# EasyEDA Pro project ProDoc_P1_2025-07-30.epro

# Schematic Schematic2_1
Board Name: v2; Create Date: 2025-06-19; Page Name: P1; Project Name: 恒流boost驱动; Schematic Name: Schematic2_1; Update Date: 2025-06-27; Company: 嘉立创EDA; Page Size: A4; Version: V1.0
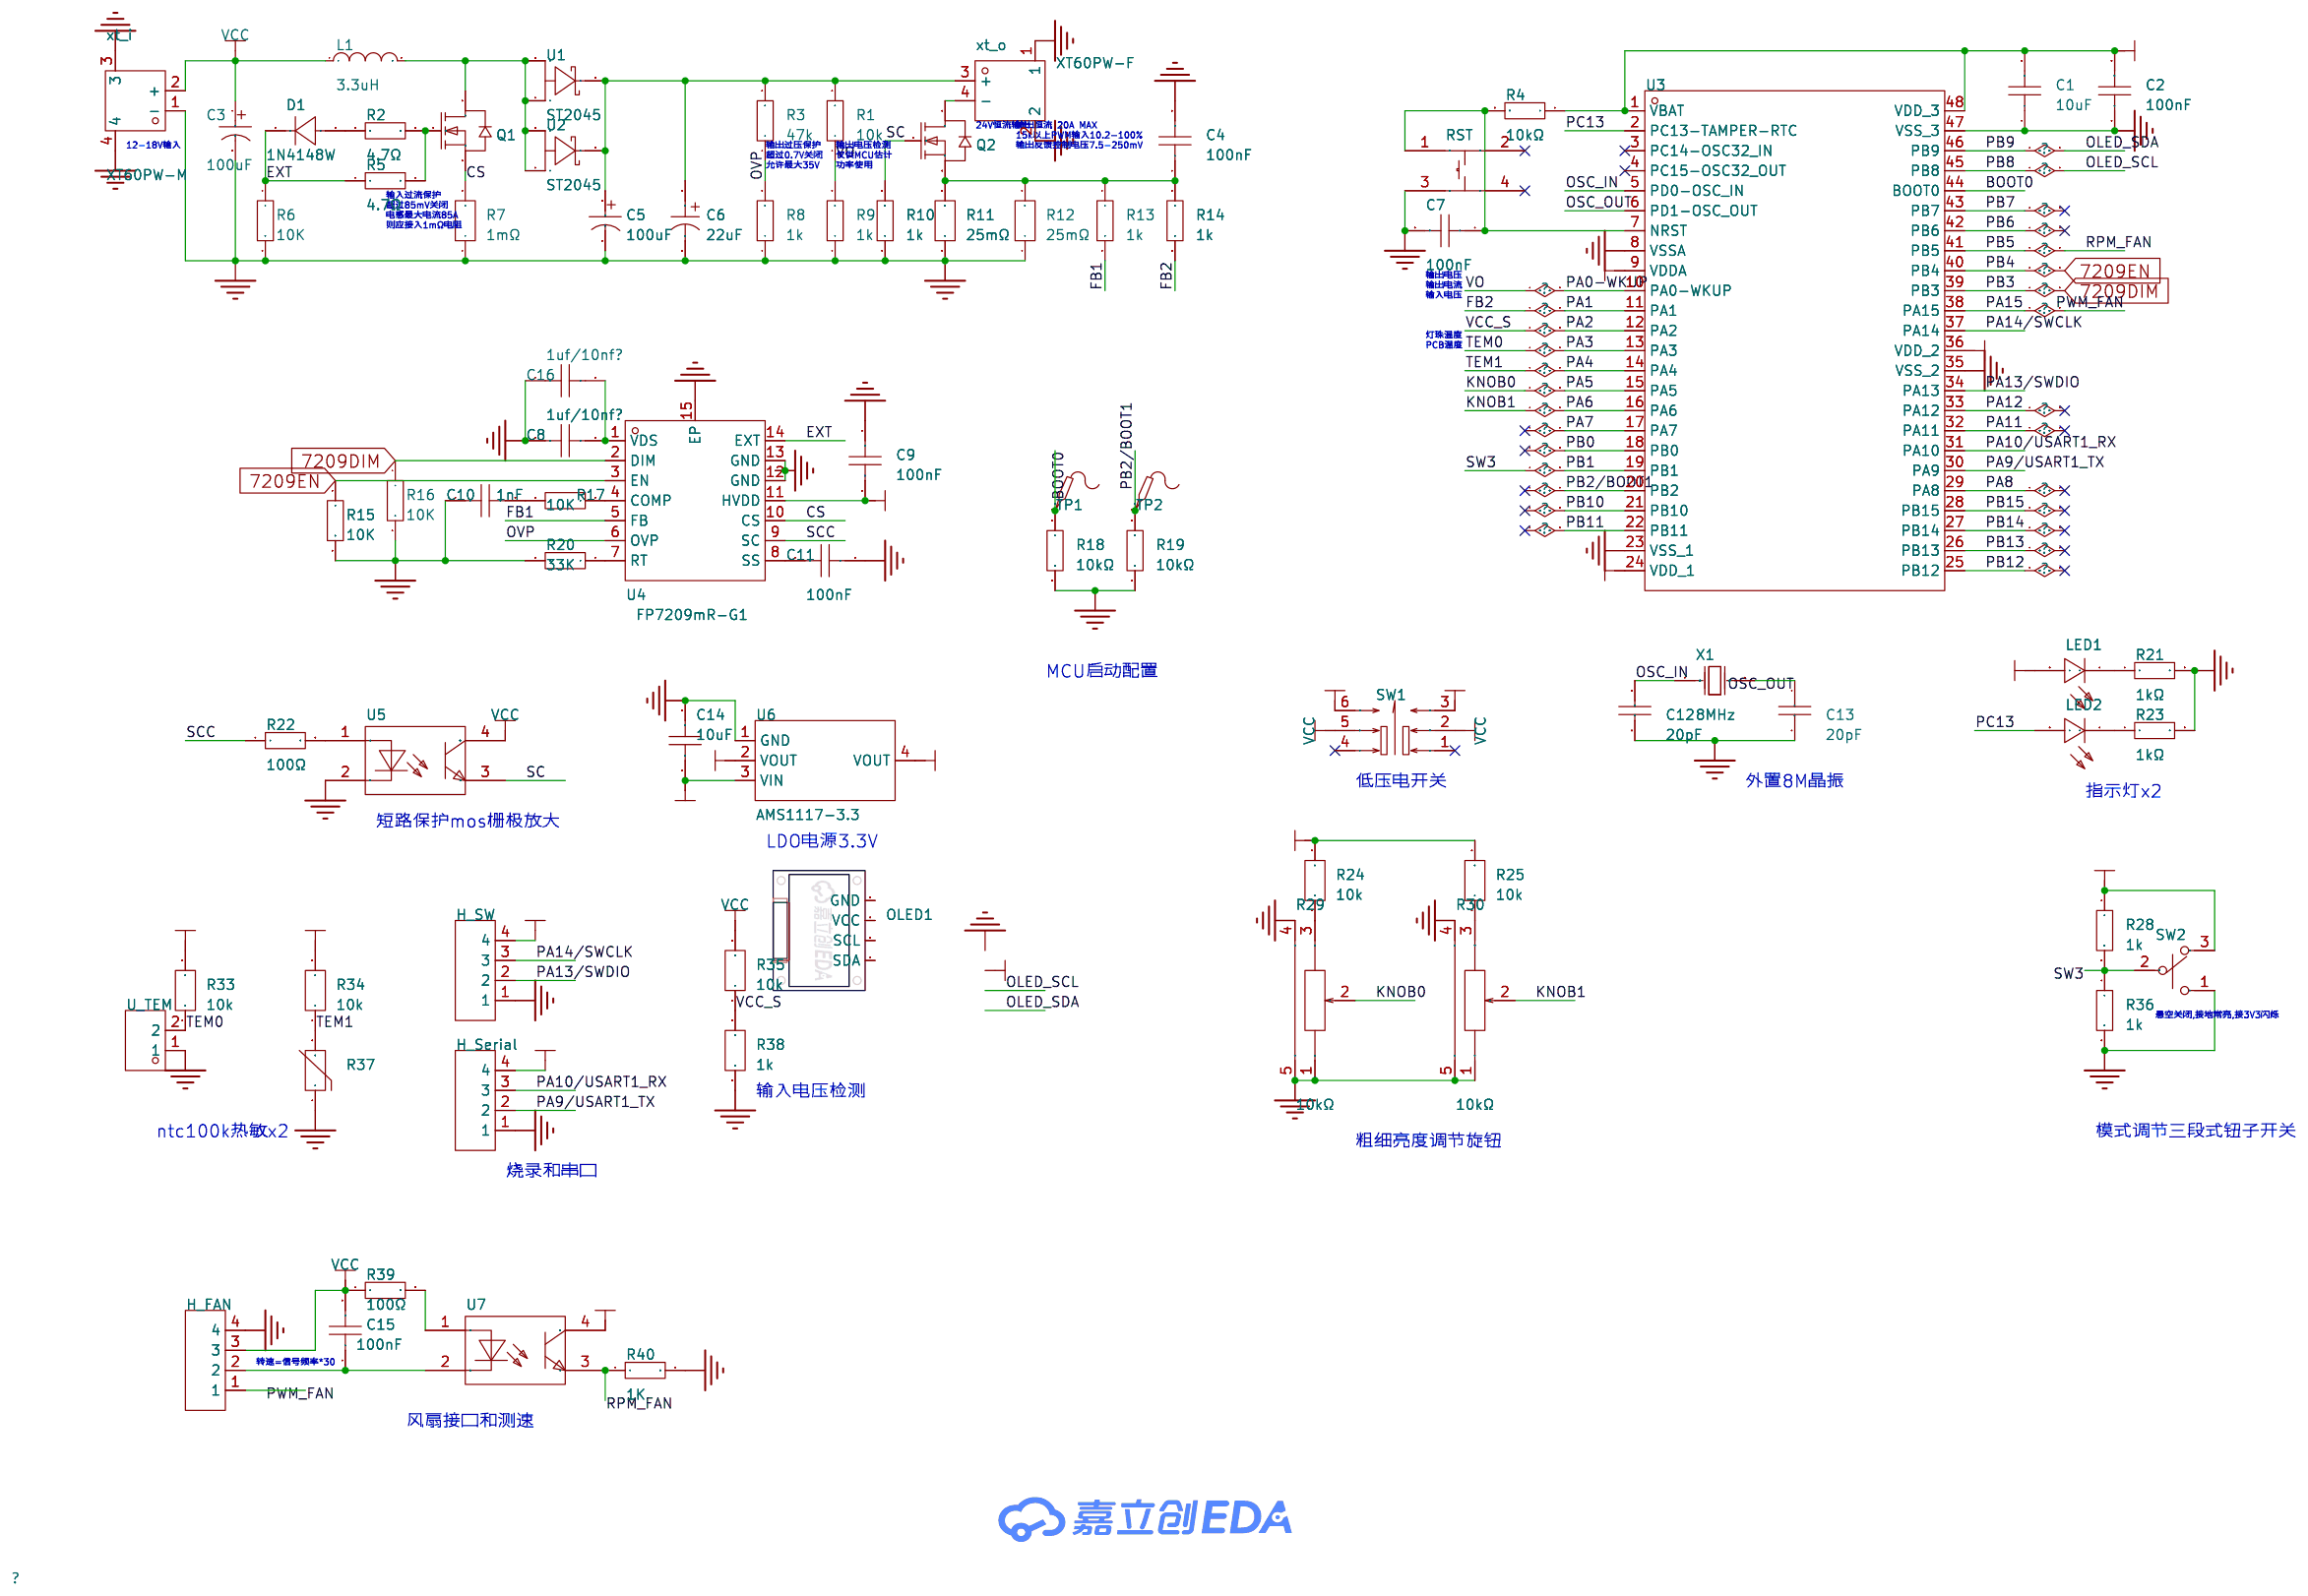
[diagram p0: schematic sheet]

## Parts
C1  10uF  [C0603]
C2  100nF  [C0603]
C3  100uF  [CAP-TH_BD8.0-P3.50-D0.6-FD]
C4  100nF  [C0603]
C5  100uF  [CAP-TH_BD8.0-P3.50-D0.6-FD]
C6  22uF  [CAP-SMD_BD6.3-L6.6-W6.6-LS7.2-R-RD-1]
C7  100nF  [C0603]
C8  1uf/10nf?  [C0603]
C9  100nF  [C0603]
C10  1nF  [C0603]
C11  100nF  [C0603]
C12  20pF  [C0603]
C13  20pF  [C0603]
C14  10uF  [C0603]
C15  100nF  [C0603]
C16  1uf/10nf?  [C0603]
D1  1N4148W  [SOD-123_L2.7-W1.6-LS3.8-RD]
H_FAN  PZ254R-11-04P  [HDR-TH_4P-P2.54-H-M-W10.4]
H_Serial  PZ254R-11-04P  [HDR-TH_4P-P2.54-H-M-W10.4]
H_SW  PZ254R-11-04P  [HDR-TH_4P-P2.54-H-M-W10.4]
L1  3.3uH  [IND-SMD_L17.5-W17.2]
LED1  NCD0603R1  [LED0603-RD_RED]
LED2  NCD0603R1  [LED0603-RD_RED]
OLED1  -  [0.96OLED_4P]
Q1  NCE6080K  [TO-252-2_L6.6-W6.1-P4.57-LS10.1-BR-CW]
Q2  NCE6080K  [TO-252-2_L6.6-W6.1-P4.57-LS10.1-BR-CW]
R1  10k  [R0603]
R2  4.7Ω  [R0603]
R3  47k  [R0603]
R4  10kΩ  [R0603]
R5  4.7Ω  [R0603]
R6  10K  [R0603]
R7  1mΩ  [R2512]
R8  1k  [R0603]
R9  1k  [R0603]
R10  1k  [R0603]
R11  25mΩ  [R2512]
R12  25mΩ  [R2512]
R13  1k  [R0603]
R14  1k  [R0603]
R15  10K  [R0603]
R16  10K  [R0603]
R17  10K  [R0603]
R18  10kΩ  [R0603]
R19  10kΩ  [R0603]
R20  33K  [R0603]
R21  1kΩ  [R0603]
R22  100Ω  [R0603]
R23  1kΩ  [R0603]
R24  10k  [R0603]
R25  10k  [R0603]
R28  1k  [R0603]
R29  10kΩ  [RES-TH_RK09K1130A70]
R30  10kΩ  [RES-TH_RK09K1130A70]
R33  10k  [R0603]
R34  10k  [R0603]
R35  10k  [R0603]
R36  1k  [R0603]
R37  TCTR0603F100KF4310T  [R0603]
R38  1k  [R0603]
R39  100Ω  [R0603]
R40  1K  [R0603]
RST  TS-1002S-07526C  [SW-SMD_4P-L6.0-W6.0-P4.50-LS9.0-2]
SW1  SP-2214  [SW-TH_6P-L8.5-W8.5-P2.54_SP-2214]
SW2  MT-0-103-A101-M200-RS  [SW-TH_MT-0-103-A101-M200-RS]
TP1  -  [Test-Point-0.5mm]
TP2  -  [Test-Point-0.5mm]
U1  ST2045  [TO-277_3P-L5.4-W4.0-LS6.5-BR]
U2  ST2045  [TO-277_3P-L5.4-W4.0-LS6.5-BR]
U3  STM32F103C8T6  [LQFP-48_L7.0-W7.0-P0.50-LS9.0-BL]
U4  FP7209mR-G1  [TSSOP-14_L5.0-W4.4-P0.65-LS6.4-BL-EP]
U5  PC817C  [DIP-4_L4.6-W6.5-P2.54-LS7.6-BL]
U6  AMS1117-3.3  [SOT-223-3_L6.5-W3.4-P2.30-LS7.0-BR]
U7  PC817C  [DIP-4_L4.6-W6.5-P2.54-LS7.6-BL]
U_TEM  ZX-XH2.54-2PWZ  [CONN-TH_2P-P2.50_ZX-XH2.54-2PWZ]
X1  8MHz  [OSC-TH_L10.0-W4.5-P5.00]
xt_i  XT60PW-M  [CONN-TH_XT60PW-M]
xt_o  XT60PW-F  [TH_2P-XT60PW-F]

## Library data of the parts
C1 C2 C4 C7 C14 = CGA0603X5R105K500JT: 容值:1uF;精度:±10%;额定电压:50V;材质(温度系数):X5R;; LCSC Part Name: 1uF ±10% 50V; Supplier Part: C6119852; Manufacturer: HRE(芯声); Supplier Footprint: 0603; JLCPCB Part Class: 扩展库; Supplier: LCSC; Tolerance: ±10%; Voltage Rated: 50V; Temperature Coefficient: X5R
C3 C5 = KM107M050F12RR0VH2FP0: 容值:100uF;精度:±20%;额定电压:50V;; LCSC Part Name: 100uF ±20% 50V; Supplier Part: C2749; Manufacturer: CX(承兴); Supplier Footprint: 插件,D8xL12mm; JLCPCB Part Class: 扩展库; Datasheet: https://atta.szlcsc.com/upload/public/pdf/source/20211027/06D6BA3719C264B639DC286D935D03EA.pdf; Supplier: LCSC; Tolerance: ±20%; Rated Voltage: 50V; Lead Spacing: 3.5mm; φD: 8mm; L: 12mm; Lifetime @ Temp: 2000hrs@105℃
C6 = HV1H226M0605PZ: 容值:22uF;精度:±20%;额定电压:50V;; LCSC Part Name: 22uF ±20% 50V; Supplier Part: C5246560; Manufacturer: HONOR(荣誉); Supplier Footprint: SMD,D6.3xL5.8mm; JLCPCB Part Class: 扩展库; Datasheet: https://atta.szlcsc.com/upload/public/pdf/source/20221103/F889AFCC379E96C645A0A58E4BAC43B0.pdf; Supplier: LCSC; Tolerance: ±20%; Rated Voltage: 50V; φD: 6.3mm; L: 5mm; Operating Temperature: -55℃~+105℃
C8-C11 C15 C16 = CAP_0603: Supplier Footprint: 0603
C12 C13 = CL10C200JB8NNNC: 容值:20pF;精度:±5%;额定电压:50V;材质(温度系数):C0G;; LCSC Part Name: 20pF ±5% 50V; Supplier Part: C1648; Manufacturer: SAMSUNG(三星); Supplier Footprint: 0603; JLCPCB Part Class: 基础库; Datasheet: https://atta.szlcsc.com/upload/public/pdf/source/20160218/1457707763339.pdf; Supplier: LCSC; Tolerance: ±5%; Voltage Rated: 50V; Temperature Coefficient: C0G
D1 = 1N4148W_C909967: 二极管配置:独立式;正向压降(Vf):1.25V@150mA;直流反向耐压(Vr):100V;整流电流:-;反向恢复时间(Trr):-;; LCSC Part Name: 电压:100V 电流:150mA; Supplier Part: C909967; Manufacturer: GOODWORK(固得沃克); Supplier Footprint: SOD-123; JLCPCB Part Class: 扩展库; Datasheet: https://atta.szlcsc.com/upload/public/pdf/source/20240802/BA80D71F54142D28B058A528BF89B76A.pdf; Supplier: LCSC; Diode Configuration: 独立式; Voltage - Forward(Vf@If): 1.25V@150mA; Voltage - DC Reverse(Vr): 100V; Reverse Leakage Current (Ir): 1uA@100V; Operating Temperature: -55℃~+150℃@(Tj)
H_FAN H_Serial H_SW = PZ254R-11-04P: 插针结构:1x4P;间距:2.54mm;行距:-;圆针/方针:方针;安装方式:弯插;排数:单排;总PIN位数:4P;额定电流:-;额定电压:-;配合针长度:6mm;塑高:2.5mm;触头材质:黄铜;触头镀层:-;工作温度:-40℃~+105℃;颜色:黑色;; LCSC Part Name: 1x4P 间距:2.54mm 方针 弯插; Supplier Part: C492412; Manufacturer: XFCN(兴飞); Supplier Footprint: 弯插,P=2.54mm; JLCPCB Part Class: 扩展库; Datasheet: https://atta.szlcsc.com/upload/public/pdf/source/20200309/C492412_B0EFFC1946AB079B8871416C4A09EF6C.pdf; Supplier: LCSC; Pin Structure: 1x4P; Pitch: 2.54mm; Circluar Pins/Square Pins: 方针; Mounting Type: 弯插; Number of Rows: 单排; Number of Pins: 4P; Length of Mating Pin: 6mm; Insulation Height: 2.5mm; Contact Material: 黄铜; Operating Temperature: -40℃~+105℃; Color: 黑色
L1 = SMMS1770-6R8M: 电感值:6.8uH;精度:±20%;额定电流:19A;饱和电流(Isat):32A;类型:一体成型电感;; LCSC Part Name: 6.8uH ±20% 32A; Supplier Part: C2976966; Manufacturer: SXN(顺翔诺); Supplier Footprint: SMD,17.5x17.15x7mm; JLCPCB Part Class: 扩展库; Datasheet: https://atta.szlcsc.com/upload/public/pdf/source/20220224/D8C8E12B51A4AD75CA32F676574334C0.pdf; Supplier: LCSC; Tolerance: ±20%; Rated Current: 19A; Saturation Current (Isat): 32A; DC Resistance (DCR): 9.2mΩ; Type: 一体成型电感
LED1 LED2 = NCD0603R1_C84263: 灯头类型:-;发光颜色:红色;正向电压(VF):1.6V~2.6V;功率:65mW;正向电流:20mA;主波长:615nm~630nm;二极管配置:独立二极管;透镜颜色:无色透明透镜;色温:-;发光强度:80mcd~220mcd;发光角度:130°;载带方式:-;工作温度:-30℃~+85℃;; Supplier Part: C84263; Manufacturer: 国星光电; Supplier Footprint: 0603; JLCPCB Part Class: 扩展库; Datasheet: https://atta.szlcsc.com/upload/public/pdf/source/20200820/C84263_DABC6A75E58F576973B407FDBA283D60.pdf; Supplier: LCSC; Emitted Color: 红色; Forward Voltage (VF): 1.6V~2.6V; Power Dissipation: 65mW; Forward Current: 20mA; Dominant Wavelength: 615nm~630nm; Diode Configuration: 独立二极管; Lens Color: 无色透明透镜; Luminous Intensity: 80mcd~220mcd; Viewing Angle: 130°; Operating Temperature: -30℃~+85℃
OLED1 = 0.96OLED模块_4P: Supplier Footprint: 插件
Q1 Q2 = NCE6080K: 类型:1个N沟道;漏源电压(Vdss):60V;连续漏极电流(Id):80A;导通电阻(RDS(on)):8.5mΩ@10V,20A;耗散功率(Pd):110W;阈值电压(Vgs(th)):4V;; LCSC Part Name: 1个N沟道 耐压:60V 电流:80A; Supplier Part: C341705; Manufacturer: NCE(无锡新洁能); Supplier Footprint: TO-252-2; JLCPCB Part Class: 扩展库; Datasheet: https://atta.szlcsc.com/upload/public/pdf/source/20181205/C341705_A98BB2E94DE599C81CD1E648BE453360.pdf; Supplier: LCSC; Type: 1个N沟道; Drain to Source Voltage: 60V; Current - Continuous Drain(Id): 80A; RDS(on): 8.5mΩ@10V,20A; Pd - Power Dissipation: 110W; Gate Threshold Voltage (Vgs(th)@Id): 4V; Gate Charge(Qg): 60nC; Input Capacitance(Ciss@Vds): 4nF@30V; Reverse Transfer Capacitance (Crss@Vds): 210pF@30V; Operating Temperature: -55℃~+175℃
R1-R3 R5 R6 R8-R10 R13-R17 R20 R22 R28 R36 R39 R40 = Res_0603: Supplier Footprint: 0603
R4 R18 R19 R21 R23 = 0603WAF1001T5E: 电阻类型:厚膜电阻;阻值:1kΩ;精度:±1%;功率:100mW;最大工作电压:75V;温度系数:±100ppm/℃;; LCSC Part Name: 1kΩ ±1% 100mW 厚膜电阻; Supplier Part: C21190; Manufacturer: UNI-ROYAL(厚声); Supplier Footprint: 0603; JLCPCB Part Class: 基础库; Datasheet: https://atta.szlcsc.com/upload/public/pdf/source/20200306/C422600_1E6D84923E4A46A82E41ADD87F860B5C.pdf; Supplier: LCSC; Type: 厚膜电阻; Tolerance: ±1%; Power(Watts): 100mW; Overload Voltage (Max): 75V; Temperature Coefficient: ±100ppm/℃; Operating Temperature Range: -55℃~+155℃
R7 R11 R12 = JER2512F3R050: 电阻类型:采样电阻;阻值:50mΩ;精度:±1%;功率:3W;温度系数:±50ppm/℃;; LCSC Part Name: 50mΩ 3W 2512 ±1%; Supplier Part: C46634452; Manufacturer: 捷而瑞; Supplier Footprint: 2512; JLCPCB Part Class: 扩展库; Datasheet: https://atta.szlcsc.com/upload/public/pdf/source/20250318/D554CC95569B02A455FAE3D181D671EA.pdf; Supplier: LCSC; Type: 采样电阻; Tolerance: ±1%; Power(Watts): 3W; Temperature Coefficient: ±50ppm/℃
R24 R25 R33-R35 R38 = FRC0603J103TS: 电阻类型:厚膜电阻;阻值:10kΩ;精度:±5%;功率:100mW;最大工作电压:75V;温度系数:±100ppm/℃;; LCSC Part Name: 10kΩ ±5% 100mW 厚膜电阻; Supplier Part: C2930027; Manufacturer: FOJAN(富捷); Supplier Footprint: 0603; JLCPCB Part Class: 扩展库; Datasheet: https://atta.szlcsc.com/upload/public/pdf/source/20211221/925EC7D7225764EE0046F22065062C87.pdf; Supplier: LCSC; Type: 厚膜电阻; Tolerance: ±5%; Power(Watts): 100mW; Overload Voltage (Max): 75V; Temperature Coefficient: ±100ppm/℃; Operating Temperature Range: -55℃~+155℃
R29 R30 = RK09K1130A70: 阻值:10kΩ;精度:±20%;; LCSC Part Name: 10kΩ ±20%; Supplier Part: C351173; Manufacturer: ALPSALPINE(阿尔卑斯阿尔派); Supplier Footprint: 插件; JLCPCB Part Class: 扩展库; Datasheet: https://atta.szlcsc.com/upload/public/pdf/source/20190114/C351243_EF2AEB29476B6A3156479704CB196A2E.pdf; Supplier: LCSC; Tolerance: ±20%
R37 = TCTR0603F100KF4310T: 阻值(25℃):100kΩ;B值(25℃/50℃):4310K;电阻精度:±1%;功率:120mW;B值精度:±1%;最大稳态电流(25℃):-;; LCSC Part Name: 100kΩ 电阻精度:±1% 4310K; Supplier Part: C525389; Manufacturer: RESI(开步睿思）; Supplier Footprint: 0603; JLCPCB Part Class: 扩展库; Datasheet: https://atta.szlcsc.com/upload/public/pdf/source/20200506/C525364_82DA399420FD8342B6C8F2E2EC87328D.pdf; Supplier: LCSC; Resistance @ 25℃: 100kΩ; B Constant (25℃/50℃): 4310K; Resistance Tolerance: ±1%; Power: 120mW; B Constant Tolerance: ±1%; Operating Temperature: -40℃~+125℃
RST = TS-1002S-07526C: 电路结构:单刀单掷;按钮形状:圆形按钮;安装方式:立贴;开关长度:6mm;开关宽度:6mm;开关高度:7.5mm;触点电流:50mA;额定电压(DC):12V;带灯:-;机械寿命:-;; LCSC Part Name: 6*6*7.5mm 立贴 轻触开关; Supplier Part: C455115; Manufacturer: XUNPU(讯普); Supplier Footprint: SMD,6x6mm; JLCPCB Part Class: 扩展库; Datasheet: https://atta.szlcsc.com/upload/public/pdf/source/20230817/980491C7294735110DBDC4AFD302A27C.pdf; Supplier: LCSC; Circuit: 单刀单掷; Actuator Style: 圆形按钮; Mounting Style: 立贴; Switch Length: 6mm; Switch Width: 6mm; Switch Height: 7.5mm; Contact Current: 50mA; Voltage Rating (DC): 12V
SW1 = SP-2214: 电路结构:双刀双掷;自锁/无锁:自锁;安装方式:直插;触点电流:100mA;额定电压 (DC):30V;作用力:2.4N;机械寿命:1.2万次;; LCSC Part Name: 自锁开关; Supplier Part: C589291; Manufacturer: RISHENG(日昇); Supplier Footprint: 插件; JLCPCB Part Class: 扩展库; Datasheet: https://atta.szlcsc.com/upload/public/pdf/source/20200922/C589291_4D429B32154294A859CAFC63DE03822C.pdf; Supplier: LCSC; Circuit: 双刀双掷; Self Lock / No Lock: 自锁; Actuator Style: 矩形柱塞; Mounting Style: 直插; Contact Current: 100mA; Voltage Rating (DC): 30V; Insulation Resistance: 100MΩ; Actuator/Cap Color: 白色; Pin Style: PC引脚; Operating Force: 2.4N; Mechanical Life: 1.2万次
SW2 = MT-0-103-A101-M200-RS: 电路结构:单刀双掷;机械寿命:-;额定电流:5A;额定电压(AC):125V;安装方式:直插;; LCSC Part Name: 小型钮子三脚三档 五件套 含配件; Supplier Part: C1788493; Manufacturer: YUEN FUNG(源丰); Supplier Footprint: 插件; JLCPCB Part Class: 扩展库; Datasheet: https://atta.szlcsc.com/upload/public/pdf/source/20230720/A7297B66510B798CA716A50870BE0E5B.pdf; Supplier: LCSC; Circuit: 单刀双掷; Switch Length: 13mm; Switch Width: 8mm; Switch Height: 28.6mm; Contact Current: 5A; Voltage Rating (AC): 125V; Actuator Type: 圆柱钮柄; Pin Style: 焊片; Mounting Style: 直插; Operating Temperature: -25℃~+85℃
TP1 TP2 = Test-Point: Test Point 测试点
U1 U2 = ST2045_C20611945: 二极管配置:独立式;正向压降(Vf):520mV@10A;直流反向耐压(Vr):45V;整流电流:20A;; LCSC Part Name: 电压:45V 电流:20A; Supplier Part: C20611945; Manufacturer: HXY MOSFET(华轩阳电子); Supplier Footprint: TO-277; JLCPCB Part Class: 扩展库; Datasheet: https://atta.szlcsc.com/upload/public/pdf/source/20240126/AC9CC52EEA2D925F653B414A85D9A72C.pdf; Supplier: LCSC; Diode Configuration: 独立式; Forward Voltage (Vf@If): 520mV@10A; Reverse Voltage (Vr): 45V; Rectified Current: 20A
U3 = STM32F103C8T6: CPU内核:CM3;程序存储容量:64KB;RAM总容量:20KB;GPIO端口数量:37;工作电压范围:2V~3.6V;CPU最大主频:72MHz;程序存储器类型:FLASH;; LCSC Part Name: STM32F103C8T6 MSL=3; Supplier Part: C8734; Manufacturer: ST(意法半导体); Supplier Footprint: LQFP-48(7x7); JLCPCB Part Class: 扩展库; Datasheet: https://atta.szlcsc.com/upload/public/pdf/source/20220812/8363ACEC51AD55ECEB84799464F7CB85.pdf; Supplier: LCSC; CPU Core: CM3; Program Storage Size: 64KB; RAM Size: 20KB; GPIO Ports Number: 37; Operating Voltage Range: 2V~3.6V; CPU Maximum Speed: 72MHz; Program Memory Type: FLASH; Operating Temperature Range: -40℃~+85℃; ADC (Bit): 12bit; Universal Serial Bus: 有; Peripheral/Function: 看门狗；DMA；看门狗；片载温度传感器; Watchdog: 有; Infrared Data Association: 有; Low-Voltage Detect: 有; Direct Memory Access: 有; Internal Oscillator: 有; Number of I/O: 37; Low Voltage Detection Threshold: 2V~3.6V
U4 = FP7209mR-G1: Supplier Part: C2762848; Manufacturer: Advanced Analog Technology(类比); Supplier Footprint: TSSOP-14-EP; JLCPCB Part Class: 扩展库; Datasheet: https://atta.szlcsc.com/upload/public/pdf/source/20210915/BA17F30BBB4CEE378D5F258F3F58057A.pdf; Supplier: LCSC
U5 U7 = PC817C_C3025068: 输入电压类型:DC;正向压降(Vf):1.2V;输出电流:50mA;隔离电压(Vrms):5kV;直流反向耐压(Vr):6V;负载电压:35V;输出通道数:1;集射极饱和电压(VCE(sat)):100mV@1mA,20mA;; LCSC Part Name: PC817C C档; Supplier Part: C3025068; Manufacturer: GOODWORK(固得沃克); Supplier Footprint: DIP-4; JLCPCB Part Class: 扩展库; Datasheet: https://atta.szlcsc.com/upload/public/pdf/source/20240807/056BF91FECDFB3570B6F9B0C0DDC2961.pdf; Supplier: LCSC; Input voltage type: DC; Output Type: 光电三极管; Voltage - Forward(Vf): 1.2V; Output Current: 50mA; Isolation Voltage(Vrms): 5kV; Reverse Voltage: 6V; Load Voltage: 35V; Number of Outputs: 1; Vce Saturation(VCE(sat)): 100mV@1mA,20mA; Rise time: 6us@2mA,100Ω; Fall time: 5us@2mA,100Ω; Operating Temperature: -55℃~+110℃; Current Transfer Ratio (CTR) Minimum: 200%; Current Transfer Ratio (CTR) Maximum/Saturation Value: 400%
U6 = AMS1117-3.3_C6186: 输出类型:固定;工作电压:-;输出电压:3.3V;输出电流:1A;电源纹波抑制比(PSRR):72dB@(120Hz);输出极性:正极;; LCSC Part Name: 输出3.3V 1A; Supplier Part: C6186; Manufacturer: AMS; Supplier Footprint: SOT-223; JLCPCB Part Class: 基础库; Datasheet: https://atta.szlcsc.com/upload/public/pdf/source/20180727/C6186_7A095716F0823C02F1997A905E26C086.pdf; Supplier: LCSC; Output Type: 固定; Output Voltage: 3.3V; Output Current: 1A; Power Supply Rejection Ratio (PSRR): 72dB@(120Hz); Voltage Dropout: 1.3V@(800mA); Features: 过流保护(OCP)；热保护(TSD); Output Configuration: 正极; Number of Outputs: 1
U_TEM = ZX-XH2.54-2PWZ: 插针结构:1x2P;间距:2.5mm;安装方式:弯插;参考系列:XH;总PIN数:2P;排数:1;每排PIN数:2;行距:-;额定电流:3A;触头材质:黄铜;触头镀层:锡;工作温度范围:-25℃~+85℃;; LCSC Part Name: 1x2P 间距:2.5mm 弯插 系列:XH; Supplier Part: C7429641; Manufacturer: Megastar(兆星); Supplier Footprint: 弯插,P=2.5mm; JLCPCB Part Class: 扩展库; Datasheet: https://atta.szlcsc.com/upload/public/pdf/source/20230619/56AE8F2E01CDFEAA97FC89B5ED558AB5.pdf; Supplier: LCSC; Pins Structure: 1x2P; Pitch: 2.5mm; Mounting Type: 弯插; Reference Series: XH; Number of Pins: 2P; Number of Rows: 1; Number of PINs Per Row: 2; Rated Current: 3A; Contact Material: 黄铜; Contact Plating: 锡; Operating Temperature: -25℃~+85℃; Rated Voltage (Max): 250V; Plastic Material: PA66; Flame Retardant Rating: UL94V-0; Color: 白色; Z-Height of the Board: 5.9mm; X-Length of Bottom Edge on Board (Spacing Line): 7.5mm; Y-Width of Bottom Edge on Board: 7.32mm
X1 = X49SD8MSD2SC: 晶振类型:直插晶振;频率:8MHz;常温频差:±20ppm;外接负载电容:20pF;频率稳定度(全温):±30ppm;; LCSC Part Name: 8MHz ±20ppm 20pF; Supplier Part: C21263; Manufacturer: YXC(扬兴晶振); Supplier Footprint: HC-49S; JLCPCB Part Class: 扩展库; Datasheet: https://atta.szlcsc.com/upload/public/pdf/source/20240329/977D7F2434F98B2BE33270BB9FF3D86D.pdf; Supplier: LCSC; Crystal Type: 直插晶振; Normal temperature Frequency Tolerance: ±20ppm; External load capacitor: 20pF; Frequency Stability(Full temperature range): ±30ppm; Operating Temperature: -20℃~+70℃
xt_i = XT60PW-M: 类别:-;类型1:-;; LCSC Part Name: AMASS(艾迈斯)航模插头xt60连接器150公母对接pw锂电池公头 板插卧式XT60PW-M; Supplier Part: C98732; Manufacturer: AMASS(艾迈斯); JLCPCB Part Class: 扩展库; Datasheet: https://atta.szlcsc.com/upload/public/pdf/source/20240118/44A3DCFF53BE25DC65378AFFB21277A4.pdf; Supplier: LCSC; Brand: 艾迈斯; Type: 卧式插头; Colour: 黄色; InterfaceType: 公头
xt_o = XT60PW-F: 类别:-;类型1:-;; LCSC Part Name: AMASS(艾迈斯)插头连接器锂电池组充电接口 航模电调卧式焊板 母头 XT60PW-F; Supplier Part: C428722; Manufacturer: AMASS(艾迈斯); JLCPCB Part Class: 扩展库; Datasheet: https://atta.szlcsc.com/upload/public/pdf/source/20190916/C428722_DFF78979486FCB0B58C1FC563067EC88.pdf; Supplier: LCSC; Type: 卧式插头; Colour: 黄色; InterfaceType: 母头

## Nets
3V3: C1.2 C2.2 H_Serial.4 H_SW.4 LED1.2(A) R4.1 R24.2 R25.2 R28.1 R33.2 R34.2 SW2.3 U3.1(VBAT) U3.9(VDDA) U3.24(VDD_1) U3.36(VDD_2) U3.48(VDD_3) U6.2(VOUT) U6.4(VOUT) U7.4(COL)
GND: C1.1 C2.1 C3.2 C4.2 C5.2 C6.2 C7.2 C8.1 C9.1 C10.1 C11.2 C12.2 C13.2 C14.2 C16.1 H_FAN.4 H_Serial.1 H_SW.1 R6.2 R7.1 R8.1 R9.1 R10.1 R11.1 R12.1 R15.2 R16.2 R18.2 R19.1 R20.2 R21.2 R23.2 R29.1 R29.4(EH) R29.5(EH) R30.1 R30.4(EH) R30.5(EH) R36.2 R37.1 R38.1 R40.2 RST.3 SW2.1 U3.8(VSSA) U3.23(VSS_1) U3.35(VSS_2) U3.47(VSS_3) U4.12(GND) U4.13(GND) U4.15(EP) U5.2(CAT) U6.1(GND) U_TEM.1 xt_i.1(-) xt_i.3 xt_i.4 xt_o.1 xt_o.2
VCC: C3.1 C15.2 H_FAN.3 L1.1 R35.2 R39.1 SW1.2 SW1.5 U5.4(COL) xt_i.2(+)
7209DIM: R16.1 U3.39(PB3) U4.2(DIM)
7209EN: R15.1 U3.40(PB4) U4.3(EN)
BOOT0: R18.1 TP1.1 U3.44(BOOT0)
CS: Q1.3(S) R7.2 U4.10(CS)
EXT: D1.1(K) R5.1 R6.1 U4.14(EXT)
FB1: R13.2 U4.5(FB)
FB2: R14.2 U3.11(PA1)
KNOB0: R29.2 U3.15(PA5)
KNOB1: R30.2 U3.16(PA6)
OLED_SCL: U3.45(PB8)
OLED_SDA: U3.46(PB9)
OSC_IN: C12.1 U3.5(PD0-OSC_IN) X1.1(OSC1)
OSC_OUT: C13.1 U3.6(PD1-OSC_OUT) X1.2(OSC2)
OVP: R3.1 R8.2 U4.6(OVP)
PA0-WKUP: R1.1 R9.2 U3.10(PA0-WKUP)
PA2: R35.1 R38.2 U3.12(PA2)
PA3: R33.1 U3.13(PA3) U_TEM.2
PA4: R34.1 R37.2 U3.14(PA4)
PA7: U3.17(PA7)
PA8: U3.29(PA8)
PA9/USART1_TX: H_Serial.2 U3.30(PA9)
PA10/USART1_RX: H_Serial.3 U3.31(PA10)
PA11: U3.32(PA11)
PA12: U3.33(PA12)
PA13/SWDIO: H_SW.2 U3.34(PA13)
PA14/SWCLK: H_SW.3 U3.37(PA14)
PA15: H_FAN.1 U3.38(PA15)
PB0: U3.18(PB0)
PB1: R28.2 R36.1 SW2.2 U3.19(PB1)
PB2/BOOT1: R19.2 TP2.1 U3.20(PB2)
PB5: R40.1 U3.41(PB5) U7.3(EM)
PB6: U3.42(PB6)
PB7: U3.43(PB7)
PB10: U3.21(PB10)
PB11: U3.22(PB11)
PB12: U3.25(PB12)
PB13: U3.26(PB13)
PB14: U3.27(PB14)
PB15: U3.28(PB15)
PC13: LED2.2(A) U3.2(PC13-TAMPER-RTC)
SC: Q2.1(G) R10.2 U5.3(EM)
SCC: R22.1 U4.9(SC)
VFP: C9.2 SW1.6 U4.11(HVDD)
VLDO: C14.1 SW1.3 U6.3(VIN)
Net-(C4-1): C4.1 Q2.3(S) R11.2 R12.2 R13.1 R14.1
Net-(C5-1): C5.1 C6.1 R1.2 R3.2 U1.2(K) U2.2(K) xt_o.3(+)
Net-(C7-1): C7.1 R4.2 RST.1 U3.7(NRST)
Net-(C8-2): C8.2 C16.2 U4.1(VDS)
Net-(C10-2): C10.2 R17.2
Net-(C11-1): C11.1 U4.8(SS)
Net-(C15-1): C15.1 H_FAN.2 U7.2(CAT)
Net-(D1-2): D1.2(A) R2.1
Net-(L1-2): L1.2 Q1.2(D) U1.1(A) U1.3(A) U2.1(A) U2.3(A)
Net-(LED1-1): LED1.1(K) R21.1
Net-(LED2-1): LED2.1(K) R23.1
Net-(Q1-1): Q1.1(G) R2.2 R5.2
Net-(Q2-2): Q2.2(D) xt_o.4(-)
Net-(R17-1): R17.1 U4.4(COMP)
Net-(R20-1): R20.1 U4.7(RT)
Net-(R22-2): R22.2 U5.1(AN)
Net-(R24-1): R24.1 R29.3
Net-(R25-1): R25.1 R30.3
Net-(R39-2): R39.2 U7.1(AN)

Not connected (* = marked no-connect by the designer): OLED1 1(GND) 2(VCC) 3(SCL) 4(SDA); RST 2* 4*; SW1 1* 4*; U3 3(PC14-OSC32_IN)* 4(PC15-OSC32_OUT)*

## Notes on the sheet
- 24V恒流输出
- 12-18V输入
- 输出恒流 20A MAX
  15k以上PWM输入10.2-100%
  输出反馈控制电压7.5-250mV
- 输出过压保护
  超过0.7V关闭
  允许最大35V
- 输出电压检测
  仅供MCU估计
  功率使用
- 输入过流保护
  超过85mV关闭
  电感最大电流85A
  则应接入1mΩ电阻
- 输出电压
  输出电流
  输入电压
- 灯珠温度
  PCB温度
- MCU启动配置
- 低压电开关
- 外置8M晶振
- 指示灯x2
- 短路保护mos栅极放大
- LDO电源3.3V
- 悬空关闭,接地常亮,接3V3闪烁
- 输入电压检测
- ntc100k热敏x2
- 粗细亮度调节旋钮
- 模式调节三段式钮子开关
- 烧录和串口
- 转速=信号频率*30
- 风扇接口和测速
